# Altium project HAB-Avionics-Sensor-Card.PrjPcb (part 2 of 3)

## Sheet Microcontroller.SchDoc: Payload Card Microcontroller
size A2; Revision: 1A; SheetNumber: 4; SheetTotal: 6; Organization: Brickworks; Address1: Matthew Glazer; Address2: Design Engineer
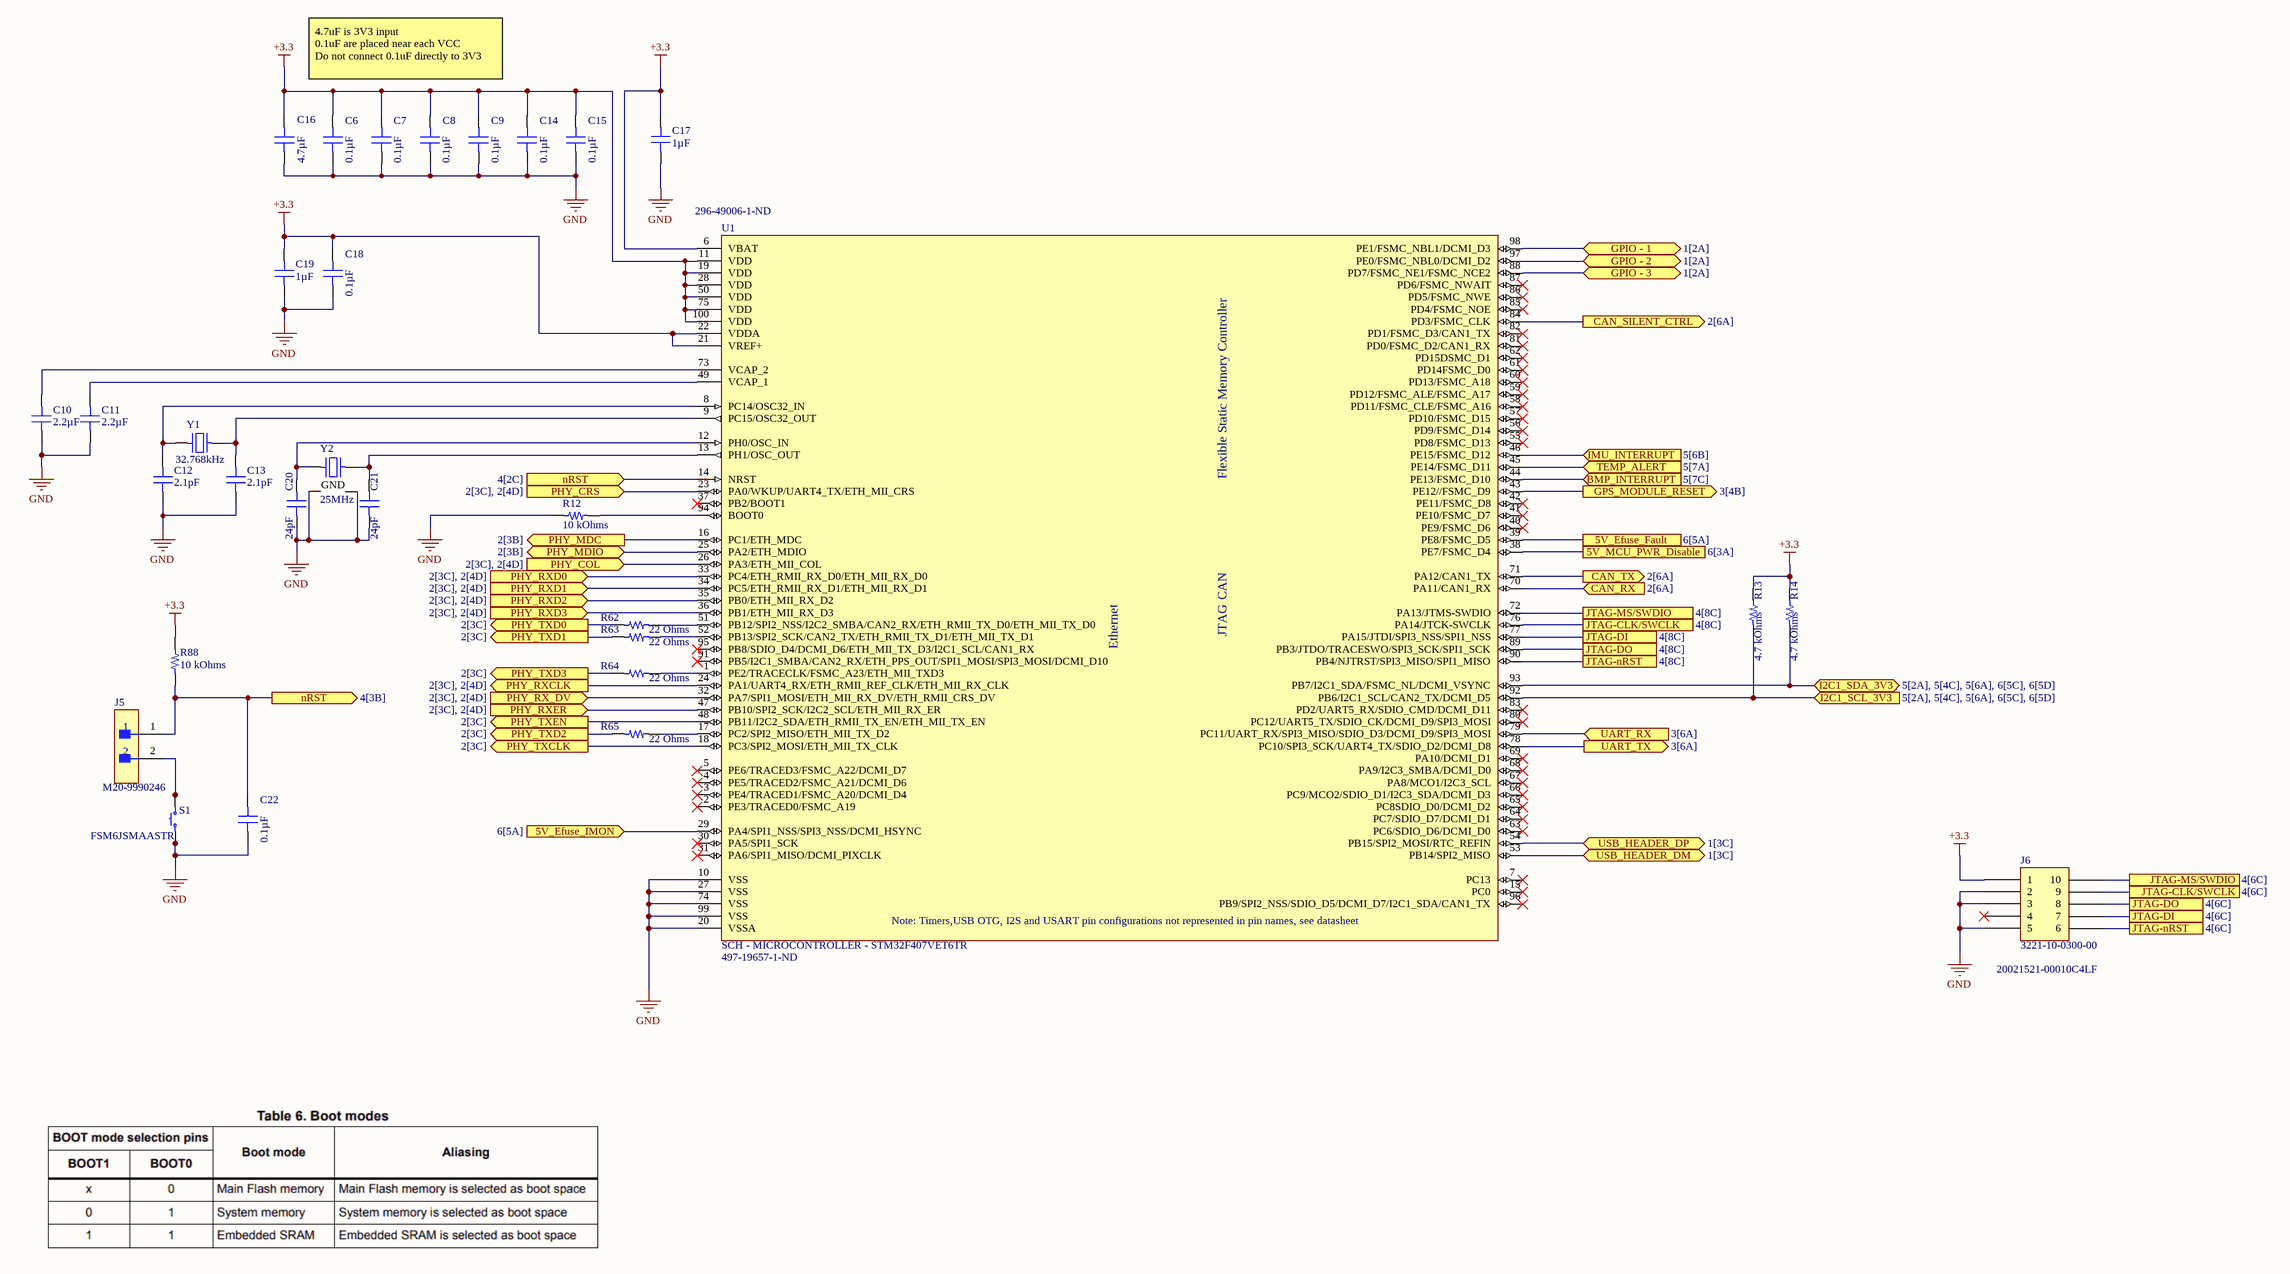
[diagram p3: Microcontroller.SchDoc]

### Parts
C6  0.1µF  [CAP 0603_1608]
C7  0.1µF  [CAP 0603_1608]
C8  0.1µF  [CAP 0603_1608]
C9  0.1µF  [CAP 0603_1608]
C10  2.2µF  [CAP 0603_1608]
C11  2.2µF  [CAP 0603_1608]
C12  2.1pF  [CAP 0603_1608]
C13  2.1pF  [CAP 0603_1608]
C14  0.1µF  [CAP 0603_1608]
C15  0.1µF  [CAP 0603_1608]
C16  4.7µF  [CAP 0603_1608]
C17  1µF  [CAP 0603_1608]
C18  0.1µF  [CAP 0603_1608]
C19  1µF  [CAP 0603_1608]
C20  24pF  [CAP 0603_1608]
C21  24pF  [CAP 0603_1608]
C22  0.1µF  [CAP 0603_1608]
J5  M20-9990246  [FP-M20-9990246-MFG]
J6  3221-10-0300-00  [CNC TECH 3221-10-0300-00]
R12  10 kOhms  [RES 0603_1608]
R13  4.7 kOhms  [RES 0603_1608]
R14  4.7 kOhms  [RES 0603_1608]
R62  22 Ohms  [RES 0603_1608]
R63  22 Ohms  [RES 0603_1608]
R64  22 Ohms  [RES 0603_1608]
R65  22 Ohms  [RES 0603_1608]
R88  10 kOhms  [RES 0603_1608]
S1  FSM6JSMAASTR  [TE FSM6JSMA]
U1  SCH - MICROCONTROLLER - STM32F407VET6TR  Supplier Part Number 1: 497-19657-1-ND  [PCB - LEADLESS - QFP - ST LQFP-100 14X14MM]
Y1  32.768kHz  [ABRACON ABS07]
Y2  25MHz  [EPSON TSX-3225]

### Ports
5V_Efuse_Fault (see 6[5A]), 5V_Efuse_IMON (in, see 6[5A]), 5V_MCU_PWR_Disable (see 6[3A]), BMP_INTERRUPT (in, see 5[7C]), CAN_RX (in, see 2[6A]), CAN_SILENT_CTRL (out, see 2[6A]), CAN_TX (out, see 2[6A]), GPIO - 1 (bidir, see 1[2A]), GPIO - 2 (bidir, see 1[2A]), GPIO - 3 (bidir, see 1[2A]), GPS_MODULE_RESET (out, see 3[4B]), I2C1_SCL_3V3 (in, see 5[2A], 5[4C], 5[6A], 6[5C], 6[5D]), I2C1_SDA_3V3 (bidir, see 5[2A], 5[4C], 5[6A], 6[5C], 6[5D]), IMU_INTERRUPT (in, see 5[6B]), JTAG-CLK/SWCLK (see 4[6C]), JTAG-CLK/SWCLK (see 4[8C]), JTAG-DI (see 4[6C]), JTAG-DI (see 4[8C]), JTAG-DO (see 4[6C]), JTAG-DO (see 4[8C]), JTAG-MS/SWDIO (see 4[6C]), JTAG-MS/SWDIO (see 4[8C]), JTAG-nRST (see 4[6C]), JTAG-nRST (see 4[8C]), nRST (in, see 4[2C]), nRST (out, see 4[3B]), PHY_COL (in, see 2[3C], 2[4D]), PHY_CRS (in, see 2[3C], 2[4D]), PHY_MDC (out, see 2[3B]), PHY_MDIO (bidir, see 2[3B]), PHY_RX_DV (in, see 2[3C], 2[4D]), PHY_RXCLK (out, see 2[3C], 2[4D]), PHY_RXD0 (in, see 2[3C], 2[4D]), PHY_RXD1 (in, see 2[3C], 2[4D]), PHY_RXD2 (in, see 2[3C], 2[4D]), PHY_RXD3 (in, see 2[3C], 2[4D]), PHY_RXER (in, see 2[3C], 2[4D]), PHY_TXCLK (out, see 2[3C]), PHY_TXD0 (out, see 2[3C]), PHY_TXD1 (out, see 2[3C]), PHY_TXD2 (out, see 2[3C]), PHY_TXD3 (out, see 2[3C]), PHY_TXEN (out, see 2[3C]), TEMP_ALERT (in, see 5[7A]), UART_RX (in, see 3[6A]), UART_TX (out, see 3[6A]), USB_HEADER_DM (bidir, see 1[3C]), USB_HEADER_DP (bidir, see 1[3C])

### Nets
+3.3: C6.2 C7.2 C8.2 C9.2 C14.2 C15.2 C16.2 C17.2 C18.2 C19.2 J6.1 R13.2 R14.2 R88.1 U1.6(VBAT) U1.11(VDD) U1.19(VDD) U1.21(VREF+) U1.22(VDDA) U1.28(VDD) U1.50(VDD) U1.75(VDD) U1.100(VDD)
GND: C6.1 C7.1 C8.1 C9.1 C10.1 C11.1 C12.1 C13.1 C14.1 C15.1 C16.1 C17.1 C18.1 C19.1 C20.1 C21.1 C22.1 J6.2 J6.3 J6.5 R12.2 S1.1 S1.2 U1.10(VSS) U1.20(VSSA) U1.27(VSS) U1.74(VSS) U1.99(VSS) Y2.2(GND) Y2.4(GND)
USB_HEADER_N: U1.53(PB14/SPI2_MISO) ; port USB_HEADER_DM
USB_HEADER_P: U1.54(PB15/SPI2_MOSI/RTC_REFIN) ; port USB_HEADER_DP
NetC10_2: C10.2 U1.73(VCAP_2)
NetC11_2: C11.2 U1.49(VCAP_1)
NetC12_2: C12.2 U1.8(PC14/OSC32_IN) Y1.1
NetC13_2: C13.2 U1.9(PC15/OSC32_OUT) Y1.2
NetC20_2: C20.2 U1.12(PH0/OSC_IN) Y2.1
NetC21_2: C21.2 U1.13(PH1/OSC_OUT) Y2.3
NetC22_2: C22.2 J5.1 R88.2 U1.14(NRST) ; port nRST
NetD3_1: U1.38(PE7/FSMC_D4) ; port 5V_MCU_PWR_Disable
NetJ1_14: U1.98(PE1/FSMC_NBL1/DCMI_D3) ; port GPIO - 1
NetJ1_15: U1.97(PE0/FSMC_NBL0/DCMI_D2) ; port GPIO - 2
NetJ1_16: U1.88(PD7/FSMC_NE1/FSMC_NCE2) ; port GPIO - 3
NetJ5_2: J5.2 S1.3 S1.4
NetJ6_6: J6.6 U1.90(PB4/NJTRST/SPI3_MISO/SPI1_MISO) ; port JTAG-nRST
NetJ6_7: J6.7 U1.77(PA15/JTDI/SPI3_NSS/SPI1_NSS) ; port JTAG-DI
NetJ6_8: J6.8 U1.89(PB3/JTDO/TRACESWO/SPI3_SCK/SPI1_SCK) ; port JTAG-DO
NetJ6_9: J6.9 U1.76(PA14/JTCK-SWCLK) ; port JTAG-CLK/SWCLK
NetJ6_10: J6.10 U1.72(PA13/JTMS-SWDIO) ; port JTAG-MS/SWDIO
NetR12_1: R12.1 U1.94(BOOT0)
NetR13_1: R13.1 U1.92(PB6/I2C1_SCL/CAN2_TX/DCMI_D5) ; port I2C1_SCL_3V3
NetR14_1: R14.1 U1.93(PB7/I2C1_SDA/FSMC_NL/DCMI_VSYNC) ; port I2C1_SDA_3V3
NetR21_1: U1.39(PE8/FSMC_D5) ; port 5V_Efuse_Fault
NetR28_2: U1.29(PA4/SPI1_NSS/SPI3_NSS/DCMI_HSYNC) ; port 5V_Efuse_IMON
NetR54_2: U1.84(PD3/FSMC_CLK) ; port CAN_SILENT_CTRL
NetR57_1: U1.25(PA2/ETH_MDIO) ; port PHY_MDIO
NetR61_1: U1.18(PC3/SPI2_MOSI/ETH_MII_TX_CLK) ; port PHY_TXCLK
NetR62_1: R62.1 ; port PHY_TXD0
NetR62_2: R62.2 U1.51(PB12/SPI2_NSS/I2C2_SMBA/CAN2_RX/ETH_RMII_TX_D0/ETH_MII_TX_D0)
NetR63_1: R63.1 ; port PHY_TXD1
NetR63_2: R63.2 U1.52(PB13/SPI2_SCK/CAN2_TX/ETH_RMII_TX_D1/ETH_MII_TX_D1)
NetR64_1: R64.1 ; port PHY_TXD3
NetR64_2: R64.2 U1.1(PE2/TRACECLK/FSMC_A23/ETH_MII_TXD3)
NetR65_1: R65.1 ; port PHY_TXD2
NetR65_2: R65.2 U1.17(PC2/SPI2_MISO/ETH_MII_TX_D2)
NetR66_1: U1.48(PB11/I2C2_SDA/ETH_RMII_TX_EN/ETH_MII_TX_EN) ; port PHY_TXEN
NetR67_1: U1.24(PA1/UART4_RX/ETH_RMII_REF_CLK/ETH_MII_RX_CLK) ; port PHY_RXCLK
NetR68_1: U1.33(PC4/ETH_RMII_RX_D0/ETH_MII_RX_D0) ; port PHY_RXD0
NetR69_1: U1.34(PC5/ETH_RMII_RX_D1/ETH_MII_RX_D1) ; port PHY_RXD1
NetR70_1: U1.35(PB0/ETH_MII_RX_D2) ; port PHY_RXD2
NetR71_1: U1.36(PB1/ETH_MII_RX_D3) ; port PHY_RXD3
NetR74_1: U1.47(PB10/SPI2_SCK/I2C2_SCL/ETH_MII_RX_ER) ; port PHY_RXER
NetR75_1: U1.32(PA7/SPI1_MOSI/ETH_MII_RX_DV/ETH_RMII_CRS_DV) ; port PHY_RX_DV
NetR77_1: U1.23(PA0/WKUP/UART4_TX/ETH_MII_CRS) ; port PHY_CRS
NetR78_1: U1.26(PA3/ETH_MII_COL) ; port PHY_COL
NetU1_16: U1.16(PC1/ETH_MDC) ; port PHY_MDC
NetU1_43: U1.43(PE12//FSMC_D9) ; port GPS_MODULE_RESET
NetU1_44: U1.44(PE13/FSMC_D10) ; port BMP_INTERRUPT
NetU1_45: U1.45(PE14/FSMC_D11) ; port TEMP_ALERT
NetU1_46: U1.46(PE15/FSMC_D12) ; port IMU_INTERRUPT
NetU1_70: U1.70(PA11/CAN1_RX) ; port CAN_RX
NetU1_71: U1.71(PA12/CAN1_TX) ; port CAN_TX
NetU1_78: U1.78(PC10/SPI3_SCK/UART4_TX/SDIO_D2/DCMI_D8) ; port UART_TX
NetU1_79: U1.79(PC11/UART_RX/SPI3_MISO/SDIO_D3/DCMI_D9/SPI3_MOSI) ; port UART_RX

Not connected (* = marked no-connect by the designer): J6 4*; U1 2(PE3/TRACED0/FSMC_A19)* 3(PE4/TRACED1/FSMC_A20/DCMI_D4)* 4(PE5/TRACED2/FSMC_A21/DCMI_D6)* 5(PE6/TRACED3/FSMC_A22/DCMI_D7)* 7(PC13)* 15(PC0)* 30(PA5/SPI1_SCK)* 31(PA6/SPI1_MISO/DCMI_PIXCLK)* 37(PB2/BOOT1)* 40(PE9/FSMC_D6)* 41(PE10/FSMC_D7)* 42(PE11/FSMC_D8)* 55(PD8/FSMC_D13)* 56(PD9/FSMC_D14)* 57(PD10/FSMC_D15)* 58(PD11/FSMC_CLE/FSMC_A16)* 59(PD12/FSMC_ALE/FSMC_A17)* 60(PD13/FSMC_A18)* 61(PD14FSMC_D0)* 62(PD15DSMC_D1)* 63(PC6/SDIO_D6/DCMI_D0)* 64(PC7/SDIO_D7/DCMI_D1)* 65(PC8SDIO_D0/DCMI_D2)* 66(PC9/MCO2/SDIO_D1/I2C3_SDA/DCMI_D3)* 67(PA8/MCO1/I2C3_SCL)* 68(PA9/I2C3_SMBA/DCMI_D0)* 69(PA10/DCMI_D1)* 80(PC12/UART5_TX/SDIO_CK/DCMI_D9/SPI3_MOSI)* 81(PD0/FSMC_D2/CAN1_RX)* 82(PD1/FSMC_D3/CAN1_TX)* 83(PD2/UART5_RX/SDIO_CMD/DCMI_D11)* 85(PD4/FSMC_NOE)* 86(PD5/FSMC_NWE)* 87(PD6/FSMC_NWAIT)* 91(PB5/I2C1_SMBA/CAN2_RX/ETH_PPS_OUT/SPI1_MOSI/SPI3_MOSI/DCMI_D10)* 95(PB8/SDIO_D4/DCMI_D6/ETH_MII_TX_D3/I2C1_SCL/CAN1_RX)* 96(PB9/SPI2_NSS/SDIO_D5/DCMI_D7/I2C1_SDA/CAN1_TX)*

### Notes on the sheet
- 4.7uF is 3V3 input
  0.1uF are placed near each VCC
  Do not connect 0.1uF directly to 3V3
- (near J6) 20021521-00010C4LF
- Title
- Size:
- Date:
- File:
- A2
- Number:
- Time:
- Revision:
- Sheet
- of
- (in symbol SCH - MICROCONTROLLER - STM32F407VET6TR) Flexible Static Memory Controller; CAN; JTAG; Ethernet; Note: Timers,USB OTG, I2S and USART pin configurations not represented in pin names, see datasheet

### Library data of the parts
C6-C9 C14 C15 C18 C22 = CL10B104KA8WPNC: CAP CER 0.1UF 25V X7R 0603; Manufacturer: Samsung Electro-Mechanics; Tolerance: ±10%; Part Number: CL10B104KA8WPNC; Value: 0.1µF; Applications: Automotive; Capacitance: 0.1µF; ComponentLink1Description: Datasheet; ComponentLink1URL: http://www.samsungsem.com/kr/support/product-search/mlcc/CL10B104KA8WPNC.jsp; ComponentLink2Description: DigiKey Link; ComponentLink2URL: http://digikey.com/product-detail/en/samsung-electro-mechanics/CL10B104KA8WPNC/1276-6717-1-ND/5961576; Device Package: 0603 (1608 Metric); Features: Open Mode; LastUpdated: 9/2/2020 1:03:30 AM; Lifecycle Status: Active; Minimum Order: 1; Mounting Type: Surface Mount, MLCC; Operating Temperature: -55°C ~ 125°C; Package / Case: 0603 (1608 Metric); Packaging: TapeAndReel; PartId: 5631; Part Status: Active; Price: 0.02; Ratings: AEC-Q200; Series: CL; Size / Dimension: 0.063" L x 0.031" W (1.60mm x 0.80mm); Supplier 1: DigiKey; Supplier Part Number 1: 1276-6717-1-ND; Temperature Coefficient: X7R; Thickness (Max): 0.035" (0.90mm); Voltage - Rated: 25V
C10 C11 = EMK107BJ225KA-T: CAP CER 2.2UF 16V X5R 0603; Manufacturer: Taiyo Yuden; Tolerance: ±10%; Part Number: EMK107BJ225KA-T; Value: 2.2µF; Applications: General Purpose; Capacitance: 2.2µF; ComponentLink1Description: Datasheet; ComponentLink1URL: https://ds.yuden.co.jp/TYCOMPAS/ut/detail?pn=EMK107BJ225KA-T  &u=M; ComponentLink2Description: DigiKey Link; ComponentLink2URL: http://digikey.com/product-detail/en/taiyo-yuden/EMK107BJ225KA-T/587-1430-1-ND/1004061; Device Package: 0603 (1608 Metric); LastUpdated: 9/2/2020 1:03:30 AM; Lifecycle Status: Active; Minimum Order: 1; Mounting Type: Surface Mount, MLCC; Operating Temperature: -55°C ~ 85°C; Package / Case: 0603 (1608 Metric); Packaging: TapeAndReel; PartId: 5619; Part Status: Active; Price: 0.02; Series: M; Size / Dimension: 0.063" L x 0.031" W (1.60mm x 0.80mm); Supplier 1: DigiKey; Supplier Part Number 1: 587-1430-1-ND; Temperature Coefficient: X5R; Thickness (Max): 0.035" (0.90mm); Voltage - Rated: 16V
C12 C13 = CBR06C219B5GAC: CAP CER RF 2.1PF 50V +/-0.1 PF C; Manufacturer: KEMET; Temperature Coefficient: C0G, NP0; Tolerance: ±0.1pF; Part Number: CBR06C219B5GAC; Value: 2.1pF; Applications: RF, Microwave, High Frequency; Capacitance: 2.1pF; ComponentLink1Description: Datasheet; ComponentLink1URL: https://api.kemet.com/component-edge/download/datasheet/CBR06C219B5GAC.pdf; ComponentLink2Description: DigiKey Link; ComponentLink2URL: http://digikey.com/product-detail/en/kemet/CBR06C219B5GAC/399-16153-1-ND/7649738; Device Package: 0603 (1608 Metric); Features: High Q, Low Loss, Ultra Low ESR; LastUpdated: 9/2/2020 1:03:15 AM; Lifecycle Status: Active; Minimum Order: 1; Mounting Type: Surface Mount, MLCC; Operating Temperature: -55°C ~ 125°C; Package / Case: 0603 (1608 Metric); Packaging: TapeAndReel; PartId: 13663; Part Status: Active; Price: 0.05; Series: CBR-SMD RF C0G; Size / Dimension: 0.063" L x 0.031" W (1.60mm x 0.80mm); Supplier 1: DigiKey; Supplier Part Number 1: 399-16153-1-ND; Thickness (Max): 0.034" (0.87mm); Voltage - Rated: 50V
C16 = C1608X5R1C475K080AC: CAP CER 4.7UF 16V X5R 0603; Manufacturer: TDK Corporation; Tolerance: ±10%; Part Number: C1608X5R1C475K080AC; Value: 4.7µF; Applications: General Purpose; Capacitance: 4.7µF; ComponentLink1Description: Datasheet; ComponentLink1URL: https://product.tdk.com/info/en/catalog/datasheets/mlcc_commercial_general_en.pdf?ref_disty=digikey; ComponentLink2Description: DigiKey Link; ComponentLink2URL: http://digikey.com/product-detail/en/tdk-corporation/C1608X5R1C475K080AC/445-7478-1-ND/2733550; Device Package: 0603 (1608 Metric); Features: Low ESL; LastUpdated: 9/2/2020 1:03:17 AM; Lifecycle Status: Active; Minimum Order: 1; Mounting Type: Surface Mount, MLCC; Operating Temperature: -55°C ~ 85°C; Package / Case: 0603 (1608 Metric); Packaging: TapeAndReel; PartId: 12901; Part Status: Active; Price: 0.06; Series: C; Size / Dimension: 0.063" L x 0.031" W (1.60mm x 0.80mm); Supplier 1: DigiKey; Supplier Part Number 1: 445-7478-1-ND; Temperature Coefficient: X5R; Thickness (Max): 0.035" (0.90mm); Voltage - Rated: 16V
C17 C19 = GCM188R71C105KA64J: CAP CER 1UF 16V X7R 0603; Manufacturer: Murata Electronics; Tolerance: ±10%; Part Number: GCM188R71C105KA64J; Value: 1µF; Applications: Automotive; Capacitance: 1µF; ComponentLink1Description: Datasheet; ComponentLink1URL: https://www.murata.com/~/media/webrenewal/support/library/catalog/products/capacitor/mlcc/c03e.ashx?la=en-us; ComponentLink2Description: DigiKey Link; ComponentLink2URL: http://digikey.com/product-detail/en/murata-electronics/GCM188R71C105KA64J/490-12657-1-ND/5797626; Device Package: 0603 (1608 Metric); LastUpdated: 9/2/2020 1:03:14 AM; Lifecycle Status: Active; Minimum Order: 1; Mounting Type: Surface Mount, MLCC; Operating Temperature: -55°C ~ 125°C; Package / Case: 0603 (1608 Metric); Packaging: TapeAndReel; PartId: 13992; Part Status: Active; Price: 0.03; Ratings: AEC-Q200; Series: GCM; Size / Dimension: 0.063" L x 0.031" W (1.60mm x 0.80mm); Supplier 1: DigiKey; Supplier Part Number 1: 490-12657-1-ND; Temperature Coefficient: X7R; Thickness (Max): 0.035" (0.90mm); Voltage - Rated: 16V
C20 C21 = CL10C240JB8NNNC: CAP CER 24PF 50V C0G/NP0 0603; Manufacturer: Samsung Electro-Mechanics; Temperature Coefficient: C0G, NP0; Tolerance: ±5%; Part Number: CL10C240JB8NNNC; Value: 24pF; Applications: General Purpose; Capacitance: 24pF; ComponentLink1Description: Datasheet; ComponentLink1URL: http://www.samsungsem.com/kr/support/product-search/mlcc/CL10C240JB8NNNC.jsp; ComponentLink2Description: DigiKey Link; ComponentLink2URL: http://digikey.com/product-detail/en/samsung-electro-mechanics/CL10C240JB8NNNC/1276-1761-1-ND/3889847; Device Package: 0603 (1608 Metric); LastUpdated: 9/2/2020 1:03:22 AM; Lifecycle Status: Active; Minimum Order: 1; Mounting Type: Surface Mount, MLCC; Operating Temperature: -55°C ~ 125°C; Package / Case: 0603 (1608 Metric); Packaging: TapeAndReel; PartId: 10003; Part Status: Active; Price: 0.01; Series: CL; Size / Dimension: 0.063" L x 0.031" W (1.60mm x 0.80mm); Supplier 1: DigiKey; Supplier Part Number 1: 1276-1761-1-ND; Thickness (Max): 0.035" (0.90mm); Voltage - Rated: 50V
J5 = CMP-15831-000009-1: CONN HEADER VERT 2POS 2.54MM; Manufacturer: Harwin; Conn Gender: Male; Conn Orientation: Vertical; Number Of Contacts: 2; Current Rating: 3A; ComponentLink2URL: https://cdn.harwin.com/pdfs/M20-999.pdf; ComponentLink2Description: Datasheet; Package: M20-9990246; Temperature: -40°C to +105°C; Octopart: https://octopart.com/m20-9990246-harwin-2590635; Mouser Description: 2.54mm (0.1") Pitch SIL Vertical PC Tail Pin Header, 6.1mm mating pin height, tin, 2 contacts; Temperature Range High: +105°C; Device Class L1: Connectors; RoHS: TRUE; Automotive: No; Height: 8.99mm; Number Of Rows: 1; Contact Material: Tin,Nickel; Category: Conn; Pitch: 2.54mm; Lead Free: Yes; Digikey Description: CONN HEADER VERT 2POS 2.54MM; Manufacturer Part Number: M20-9990246; Temperature Range Low: -40°C; Device Class L3: unset; Device Class L2: Headers and Wire Housings
J6 = 3221-10-0300-00: CONN HEADER SMD 10POS 1.27MM; Manufacturer: CNC Tech; Current Rating (Amps): 1A; Material Flammability Rating: UL94 V-0; Number of Positions: 10; Number of Positions Loaded: All; Pitch - Mating: 0.050" (1.27mm); Shrouding: Shrouded - 4 Wall; Style: Board to Cable/Wire; Part Number: 3221-10-0300-00; ComponentLink1Description: Datasheet; ComponentLink1URL: http://cnctech.us/idcmatching2.pdf; ComponentLink2Description: DigiKey Link; ComponentLink2URL: http://digikey.com/product-detail/en/cnc-tech/3221-10-0300-00/1175-1735-ND/4878946; Connector Type: Header; Contact Finish - Mating: Gold; Contact Finish - Post: Gold; Contact Finish Thickness - Mating: Flash; Contact Material: Brass; Contact Shape: Square; Contact Type: Male Pin; Fastening Type: Push-Pull; Features: Keying Slot; Insulation Height: 0.213" (5.40mm); Insulation Material: Polyamide (PA6T), Nylon 6T; LastUpdated: 1/13/2020 12:09:21 AM; Lifecycle Status: Active; Minimum Order: 1; Mounting Type: Surface Mount; Number of Rows: 2; Operating Temperature: -40°C ~ 105°C; Packaging: Tray; PartId: 109; Part Status: Active; Price: 0.73; Row Spacing - Mating: 0.050" (1.27mm); Series: -; Supplier 1: DigiKey; Supplier Part Number 1: 1175-1735-ND; Termination: Solder
R12 R88 = RMCF0603JT10K0: RES 10K OHM 5% 1/10W 0603; Manufacturer: Stackpole Electronics Inc; Power (Watts): 0.1W, 1/10W; Temperature Coefficient: ±200ppm/°C; Part Number: RMCF0603JT10K0; Value: 10 kOhms; ComponentLink1Description: Datasheet; ComponentLink1URL: https://www.seielect.com/catalog/sei-packaging.pdf; ComponentLink2Description: DigiKey Link; ComponentLink2URL: http://digikey.com/product-detail/en/stackpole-electronics-inc/RMCF0603JT10K0/RMCF0603JT10K0CT-ND/1943191; Composition: Thick Film; Device Package: 0603 (1608 Metric); Features: Automotive AEC-Q200; Height - Seated (Max): 0.022" (0.55mm); LastUpdated: 8/30/2020 8:48:45 PM; Lifecycle Status: Active; Minimum Order: 1; Number of Terminations: 2; Operating Temperature: -55°C ~ 155°C; Package / Case: 0603 (1608 Metric); Packaging: CutTape; PartId: 25659; Part Status: Active; Price: 0.10; Ratings: AEC-Q200; Resistance: 10 kOhms; Series: RMCF; Size / Dimension: 0.061" L x 0.031" W (1.55mm x 0.80mm); Supplier 1: DigiKey; Supplier Part Number 1: RMCF0603JT10K0CT-ND; Supplier Device Package: 0603; Tolerance: ±5%
R13 R14 = RMCF0603FT4K70: RES 4.7K OHM 1% 1/10W 0603; Manufacturer: Stackpole Electronics Inc; Power (Watts): 0.1W, 1/10W; Temperature Coefficient: ±100ppm/°C; Part Number: RMCF0603FT4K70; Value: 4.7 kOhms; ComponentLink1Description: Datasheet; ComponentLink1URL: https://www.seielect.com/catalog/sei-rmcf_rmcp.pdf; ComponentLink2Description: DigiKey Link; ComponentLink2URL: http://digikey.com/product-detail/en/stackpole-electronics-inc/RMCF0603FT4K70/RMCF0603FT4K70CT-ND/1943033; Composition: Thick Film; Device Package: 0603 (1608 Metric); Features: Automotive AEC-Q200; Height - Seated (Max): 0.022" (0.55mm); LastUpdated: 9/2/2020 1:10:22 AM; Lifecycle Status: Active; Minimum Order: 1; Number of Terminations: 2; Operating Temperature: -55°C ~ 155°C; Package / Case: 0603 (1608 Metric); Packaging: CutTape; PartId: 6078; Part Status: Active; Price: 0.10; Ratings: AEC-Q200; Resistance: 4.7 kOhms; Series: RMCF; Size / Dimension: 0.061" L x 0.031" W (1.55mm x 0.80mm); Supplier 1: DigiKey; Supplier Part Number 1: RMCF0603FT4K70CT-ND; Supplier Device Package: 0603; Tolerance: ±1%
R62-R65 = RMCF0603FT22R0: RES 22 OHM 1% 1/10W 0603; Manufacturer: Stackpole Electronics Inc; Power (Watts): 0.1W, 1/10W; Temperature Coefficient: ±100ppm/°C; Part Number: RMCF0603FT22R0; Value: 22 Ohms; ComponentLink1Description: Datasheet; ComponentLink1URL: https://www.seielect.com/catalog/sei-packaging.pdf; ComponentLink2Description: DigiKey Link; ComponentLink2URL: http://digikey.com/product-detail/en/stackpole-electronics-inc/RMCF0603FT22R0/RMCF0603FT22R0CT-ND/1942946; Composition: Thick Film; Device Package: 0603 (1608 Metric); Features: Automotive AEC-Q200; Height - Seated (Max): 0.022" (0.55mm); LastUpdated: 9/2/2020 1:10:13 AM; Lifecycle Status: Active; Minimum Order: 1; Number of Terminations: 2; Operating Temperature: -55°C ~ 155°C; Package / Case: 0603 (1608 Metric); Packaging: CutTape; PartId: 10611; Part Status: Active; Price: 0.10; Ratings: AEC-Q200; Resistance: 22 Ohms; Series: RMCF; Size / Dimension: 0.061" L x 0.031" W (1.55mm x 0.80mm); Supplier 1: DigiKey; Supplier Part Number 1: RMCF0603FT22R0CT-ND; Supplier Device Package: 0603; Tolerance: ±1%
S1 = FSM6JSMAASTR: SWITCH TACTILE SPST-NO 0.05A 24V; Manufacturer: TE Connectivity ALCOSWITCH Switches; Actuator Height off PCB, Vertical: 7.00mm; Actuator Orientation: Top Actuated; Actuator Type: Standard; Contact Rating @ Voltage: 0.05A @ 24VDC; Illumination: Non-Illuminated; Operating Force: 260gf; Outline: 6.00mm x 6.00mm; Switch Function: Off-Mom; Part Number: FSM6JSMAASTR; Circuit: SPST-NO; ComponentLink1Description: Datasheet; ComponentLink1URL: https://www.te.com/commerce/DocumentDelivery/DDEController?Action=srchrtrv&DocNm=1308111-1_SWITCHES_CORE_PROGRAM_CATALOG&DocType=CS&DocLang=English; ComponentLink2Description: DigiKey Link; ComponentLink2URL: http://digikey.com/product-detail/en/te-connectivity-alcoswitch-switches/FSM6JSMAASTR/450-2138-1-ND/5343818; LastUpdated: 9/2/2020 1:27:08 AM; Lifecycle Status: Active; Minimum Order: 1; Mounting Type: Surface Mount; Operating Temperature: -40°C ~ 105°C; Packaging: TapeAndReel; Part Status: Active; Price: 0.37; Series: FSMJSMA; Supplier 1: DigiKey; Supplier Part Number 1: 450-2138-1-ND; Termination Style: Gull Wing
Y1 = ABS07-166-32.768KHZ-T: IOT 32.786KHZ XTAL; Manufacturer: Abracon LLC; ESR (Equivalent Series Resistance): 70 kOhms; Frequency Tolerance: ±10ppm; Load Capacitance: 7pF; Operating Mode: Fundamental; Part Number: ABS07-166-32.768KHZ-T; ComponentLink1Description: Datasheet; ComponentLink1URL: https://abracon.com/datasheets/ABS07-166-32.768kHz-T.pdf; ComponentLink2Description: DigiKey Link; ComponentLink2URL: http://digikey.com/product-detail/en/abracon-llc/ABS07-166-32.768KHZ-T/535-14514-1-ND/8827205; Frequency: 32.768kHz; Height - Seated (Max): 0.035" (0.90mm); LastUpdated: 9/2/2020 1:21:47 AM; Lifecycle Status: Active; Minimum Order: 1; Mounting Type: Surface Mount; Operating Temperature: -40°C ~ 85°C; Package / Case: 2-SMD, No Lead; Packaging: TapeAndReel; PartId: 384; Part Status: Active; Price: 0.35; Series: ABS07; Size / Dimension: 0.126" L x 0.059" W (3.20mm x 1.50mm); Supplier 1: DigiKey; Supplier Part Number 1: 535-14514-1-ND; Type: kHz Crystal (Tuning Fork); Value: 32.768kHz
Y2 = TSX-3225 25.0000MF20P-C0: CRYSTAL 25.0000MHZ 18PF SMD; Manufacturer: EPSON; ESR (Equivalent Series Resistance): 40 Ohms; Frequency Stability: ±20ppm; Frequency Tolerance: ±10ppm; Operating Mode: Fundamental; Part Number: TSX-3225 25.0000MF20P-C0; ComponentLink1Description: Datasheet; ComponentLink1URL: https://support.epson.biz/td/api/doc_check.php?dl=brief_TSX-3225&lang=en; ComponentLink2Description: DigiKey Link; ComponentLink2URL: http://digikey.com/product-detail/en/epson/TSX-3225-25.0000MF20P-C0/SER4212CT-ND/7430967; Frequency: 25MHz; Height - Seated (Max): 0.024" (0.60mm); LastUpdated: 9/2/2020 1:21:54 AM; Lifecycle Status: Active; Load Capacitance: 18pF; Minimum Order: 1; Mounting Type: Surface Mount; Operating Temperature: -20°C ~ 85°C; Package / Case: 4-SMD, No Lead; Packaging: TapeAndReel; PartId: 447; Part Status: Active; Price: 0.18; Series: TSX-3225; Size / Dimension: 0.126" L x 0.098" W (3.20mm x 2.50mm); Supplier 1: DigiKey; Supplier Part Number 1: SER4212CT-ND; Type: MHz Crystal; Value: 25MHz
U1 = SCH - MICROCONTROLLER - STM32F407VET6TR: Supplier 1: Digi-Key

## Sheet Sensors.SchDoc: Payload Card Sensors
size A3; Revision: 1A; SheetNumber: 5; SheetTotal: 6; Organization: Brickworks; Address1: Matthew Glazer; Address2: Design Engineer
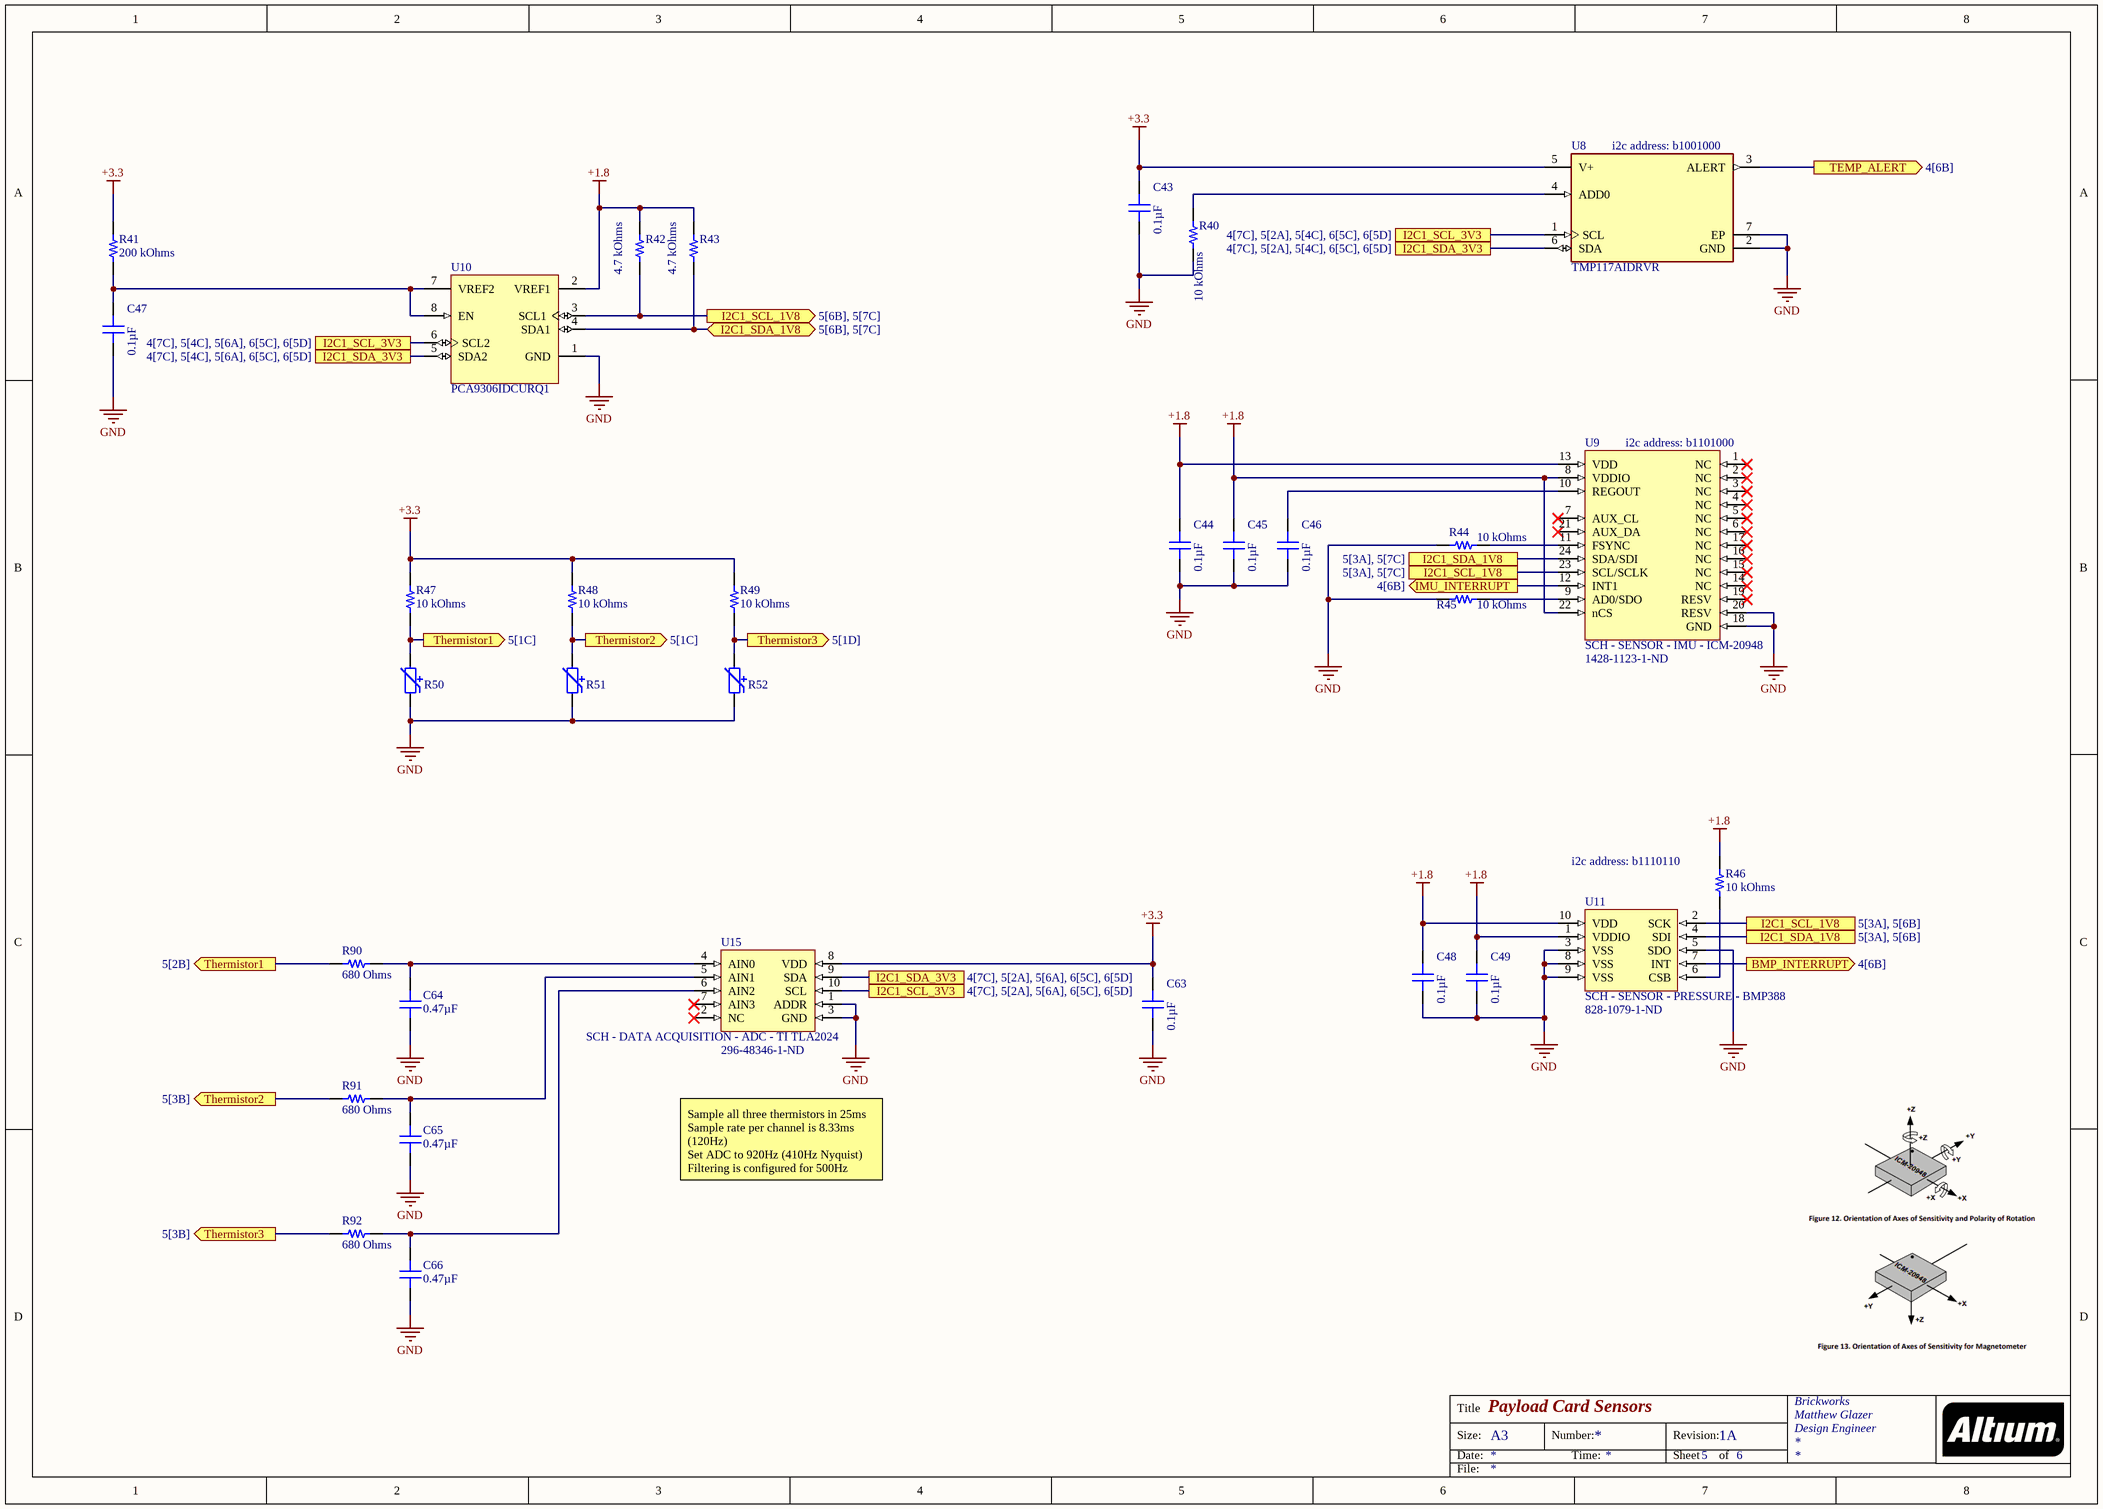
[diagram p4: Sensors.SchDoc]

### Parts
C43  0.1µF  [CAP 0603_1608]
C44  0.1µF  [CAP 0603_1608]
C45  0.1µF  [CAP 0603_1608]
C46  0.1µF  [CAP 0603_1608]
C47  0.1µF  [CAP 0603_1608]
C48  0.1µF  [CAP 0603_1608]
C49  0.1µF  [CAP 0603_1608]
C63  0.1µF  [CAP 0603_1608]
C64  0.47µF  [CAP 0603_1608]
C65  0.47µF  [CAP 0603_1608]
C66  0.47µF  [CAP 0603_1608]
R40  10 kOhms  [RES 0603_1608]
R41  200 kOhms  [RES 0603_1608]
R42  4.7 kOhms  [RES 0603_1608]
R43  4.7 kOhms  [RES 0603_1608]
R44  10 kOhms  [RES 0603_1608]
R45  10 kOhms  [RES 0603_1608]
R46  10 kOhms  [RES 0603_1608]
R47  10 kOhms  [RES 0603_1608]
R48  10 kOhms  [RES 0603_1608]
R49  10 kOhms  [RES 0603_1608]
R50  10 kOhms  [PTC 0402_1005]  (value not drawn)
R51  10 kOhms  [PTC 0402_1005]  (value not drawn)
R52  10 kOhms  [PTC 0402_1005]  (value not drawn)
R90  680 Ohms  [RES 0603_1608]
R91  680 Ohms  [RES 0603_1608]
R92  680 Ohms  [RES 0603_1608]
U8  TMP117AIDRVR  [FP-DRV0006A-MFG]
U9  SCH - SENSOR - IMU - ICM-20948  Supplier Part Number 1: 1428-1123-1-ND  [PCB - LEADLESS - QFN - TDK 24-TFQFN]
U10  PCA9306IDCURQ1  [DCU0008A_M]
U11  SCH - SENSOR - PRESSURE - BMP388  Supplier Part Number 1: 828-1079-1-ND  [PCB - LEADLESS - BOSCH LGA10]
U15  SCH - DATA ACQUISITION - ADC - TI TLA2024  Supplier Part Number 1: 296-48346-1-ND  [PCB - LEADLESS - QFN - TI X2QFN-10]

### Ports
BMP_INTERRUPT (out, see 4[6B]), I2C1_SCL_1V8 (out, see 5[6B], 5[7C]), I2C1_SCL_1V8 (see 5[3A], 5[6B]), I2C1_SCL_1V8 (see 5[3A], 5[7C]), I2C1_SCL_3V3 (see 4[7C], 5[2A], 5[4C], 6[5C], 6[5D]), I2C1_SCL_3V3 (see 4[7C], 5[2A], 5[6A], 6[5C], 6[5D]), I2C1_SCL_3V3 (see 4[7C], 5[4C], 5[6A], 6[5C], 6[5D]), I2C1_SDA_1V8 (bidir, see 5[6B], 5[7C]), I2C1_SDA_1V8 (see 5[3A], 5[6B]), I2C1_SDA_1V8 (see 5[3A], 5[7C]), I2C1_SDA_3V3 (see 4[7C], 5[2A], 5[4C], 6[5C], 6[5D]), I2C1_SDA_3V3 (see 4[7C], 5[2A], 5[6A], 6[5C], 6[5D]), I2C1_SDA_3V3 (see 4[7C], 5[4C], 5[6A], 6[5C], 6[5D]), IMU_INTERRUPT (out, see 4[6B]), TEMP_ALERT (out, see 4[6B]), Thermistor1 (out, see 5[1C]), Thermistor1 (out, see 5[2B]), Thermistor2 (out, see 5[1C]), Thermistor2 (out, see 5[3B]), Thermistor3 (out, see 5[1D]), Thermistor3 (out, see 5[3B])

### Nets
+1.8: C44.2 C45.2 C48.2 C49.2 R42.2 R43.2 R46.1 U9.8(VDDIO) U9.13(VDD) U9.22(nCS) U10.2(VREF1) U11.1(VDDIO) U11.10(VDD)
+3.3: C43.2 C63.2 R41.2 R47.2 R48.2 R49.2 U8.5(V+) U15.8(VDD)
GND: C43.1 C44.1 C45.1 C46.1 C47.1 C48.1 C49.1 C63.1 C64.1 C65.1 C66.1 R40.1 R44.2 R45.2 R50.1 R51.1 R52.1 U8.2(GND) U8.7(EP) U9.18(GND) U9.20(RESV) U10.1(GND) U11.3(VSS) U11.5(SDO) U11.8(VSS) U11.9(VSS) U15.1(ADDR) U15.3(GND)
NetC46_2: C46.2 U9.10(REGOUT)
NetC47_2: C47.2 R41.1 U10.7(VREF2) U10.8(EN)
NetC64_2: C64.2 R90.2 U15.4(AIN0)
NetC65_2: C65.2 R91.2 U15.5(AIN1)
NetC66_2: C66.2 R92.2 U15.6(AIN2)
NetR13_1: U8.1(SCL) U10.6(SCL2) U15.10(SCL) ; port I2C1_SCL_3V3
NetR14_1: U8.6(SDA) U10.5(SDA2) U15.9(SDA) ; port I2C1_SDA_3V3
NetR40_2: R40.2 U8.4(ADD0)
NetR42_1: R42.1 U9.23(SCL/SCLK) U10.3(SCL1) U11.2(SCK) ; port I2C1_SCL_1V8
NetR43_1: R43.1 U9.24(SDA/SDI) U10.4(SDA1) U11.4(SDI) ; port I2C1_SDA_1V8
NetR44_1: R44.1 U9.11(FSYNC)
NetR45_1: R45.1 U9.9(AD0/SDO)
NetR46_2: R46.2 U11.6(CSB)
NetR47_1: R47.1 R50.2 R90.1 ; port Thermistor1
NetR48_1: R48.1 R51.2 R91.1 ; port Thermistor2
NetR49_1: R49.1 R52.2 R92.1 ; port Thermistor3
NetU1_44: U11.7(INT) ; port BMP_INTERRUPT
NetU1_45: U8.3(ALERT) ; port TEMP_ALERT
NetU1_46: U9.12(INT1) ; port IMU_INTERRUPT

Not connected (* = marked no-connect by the designer): U9 1(NC)* 2(NC)* 3(NC)* 4(NC)* 5(NC)* 6(NC)* 7(AUX_CL)* 14(NC)* 15(NC)* 16(NC)* 17(NC)* 19(RESV)* 21(AUX_DA)*; U15 2(NC)* 7(AIN3)*

### Notes on the sheet
- (near U8) i2c address: b1001000
- (near U9) i2c address: b1101000
- (near R46) i2c address: b1110110
- Sample all three thermistors in 25ms
  Sample rate per channel is 8.33ms (120Hz)
  Set ADC to 920Hz (410Hz Nyquist)
  Filtering is configured for 500Hz
- Title
- Size:
- Date:
- A3
- Number:
- Time:
- Revision:
- Sheet
- of
- File:

### Library data of the parts
C43-C49 C63 = CL10B104KA8WPNC: as C6 on sheet Microcontroller; Part Number: CL10B104KA8WPNC; Value: 0.1µF; Applications: Automotive; Capacitance: 0.1µF; ComponentLink1Description: Datasheet; ComponentLink1URL: http://www.samsungsem.com/kr/support/product-search/mlcc/CL10B104KA8WPNC.jsp; ComponentLink2Description: DigiKey Link; ComponentLink2URL: http://digikey.com/product-detail/en/samsung-electro-mechanics/CL10B104KA8WPNC/1276-6717-1-ND/5961576; Device Package: 0603 (1608 Metric); Features: Open Mode; LastUpdated: 9/2/2020 1:03:30 AM; Lifecycle Status: Active; Minimum Order: 1; Mounting Type: Surface Mount, MLCC; Operating Temperature: -55°C ~ 125°C; Package / Case: 0603 (1608 Metric); Packaging: TapeAndReel; PartId: 5631; Part Status: Active; Price: 0.02; Ratings: AEC-Q200; Series: CL; Size / Dimension: 0.063" L x 0.031" W (1.60mm x 0.80mm); Supplier 1: DigiKey; Supplier Part Number 1: 1276-6717-1-ND; Temperature Coefficient: X7R; Thickness (Max): 0.035" (0.90mm); Voltage - Rated: 25V
C64-C66 = C0603C474K4PACTU: CAP CER 0.47UF 16V X5R 0603; Manufacturer: KEMET; Tolerance: ±10%; Part Number: C0603C474K4PACTU; Value: 0.47µF; Applications: General Purpose; Capacitance: 0.47µF; ComponentLink1Description: Datasheet; ComponentLink1URL: https://api.kemet.com/component-edge/download/datasheet/C0603C474K4PACTU.pdf; ComponentLink2Description: DigiKey Link; ComponentLink2URL: http://digikey.com/product-detail/en/kemet/C0603C474K4PACTU/399-7934-1-ND/3471657; Device Package: 0603 (1608 Metric); LastUpdated: 9/2/2020 1:03:36 AM; Lifecycle Status: Active; Minimum Order: 1; Mounting Type: Surface Mount, MLCC; Operating Temperature: -55°C ~ 85°C; Package / Case: 0603 (1608 Metric); Packaging: TapeAndReel; PartId: 2292; Part Status: Active; Price: 0.02; Series: SMD Comm X5R; Size / Dimension: 0.063" L x 0.031" W (1.60mm x 0.80mm); Supplier 1: DigiKey; Supplier Part Number 1: 399-7934-1-ND; Temperature Coefficient: X5R; Thickness (Max): 0.034" (0.87mm); Voltage - Rated: 16V
R40 R44-R46 = RMCF0603JT10K0: as R12 on sheet Microcontroller; Part Number: RMCF0603JT10K0; Value: 10 kOhms; ComponentLink1Description: Datasheet; ComponentLink1URL: https://www.seielect.com/catalog/sei-packaging.pdf; ComponentLink2Description: DigiKey Link; ComponentLink2URL: http://digikey.com/product-detail/en/stackpole-electronics-inc/RMCF0603JT10K0/RMCF0603JT10K0CT-ND/1943191; Composition: Thick Film; Device Package: 0603 (1608 Metric); Features: Automotive AEC-Q200; Height - Seated (Max): 0.022" (0.55mm); LastUpdated: 8/30/2020 8:48:45 PM; Lifecycle Status: Active; Minimum Order: 1; Number of Terminations: 2; Operating Temperature: -55°C ~ 155°C; Package / Case: 0603 (1608 Metric); Packaging: CutTape; PartId: 25659; Part Status: Active; Price: 0.10; Ratings: AEC-Q200; Resistance: 10 kOhms; Series: RMCF; Size / Dimension: 0.061" L x 0.031" W (1.55mm x 0.80mm); Supplier 1: DigiKey; Supplier Part Number 1: RMCF0603JT10K0CT-ND; Supplier Device Package: 0603; Tolerance: ±5%
R41 = RMCF0603FT200K: RES 200K OHM 1% 1/10W 0603; Manufacturer: Stackpole Electronics Inc; Power (Watts): 0.1W, 1/10W; Temperature Coefficient: ±100ppm/°C; Part Number: RMCF0603FT200K; Value: 200 kOhms; ComponentLink1Description: Datasheet; ComponentLink1URL: https://www.seielect.com/catalog/sei-rmcf_rmcp.pdf; ComponentLink2Description: DigiKey Link; ComponentLink2URL: http://digikey.com/product-detail/en/stackpole-electronics-inc/RMCF0603FT200K/RMCF0603FT200KCT-ND/1943126; Composition: Thick Film; Device Package: 0603 (1608 Metric); Features: Automotive AEC-Q200; Height - Seated (Max): 0.022" (0.55mm); LastUpdated: 9/2/2020 1:10:13 AM; Lifecycle Status: Active; Minimum Order: 1; Number of Terminations: 2; Operating Temperature: -55°C ~ 155°C; Package / Case: 0603 (1608 Metric); Packaging: CutTape; PartId: 10646; Part Status: Active; Price: 0.10; Ratings: AEC-Q200; Resistance: 200 kOhms; Series: RMCF; Size / Dimension: 0.061" L x 0.031" W (1.55mm x 0.80mm); Supplier 1: DigiKey; Supplier Part Number 1: RMCF0603FT200KCT-ND; Supplier Device Package: 0603; Tolerance: ±1%
R42 R43 = RMCF0603FT4K70: as R13 on sheet Microcontroller; Part Number: RMCF0603FT4K70; Value: 4.7 kOhms; ComponentLink1Description: Datasheet; ComponentLink1URL: https://www.seielect.com/catalog/sei-rmcf_rmcp.pdf; ComponentLink2Description: DigiKey Link; ComponentLink2URL: http://digikey.com/product-detail/en/stackpole-electronics-inc/RMCF0603FT4K70/RMCF0603FT4K70CT-ND/1943033; Composition: Thick Film; Device Package: 0603 (1608 Metric); Features: Automotive AEC-Q200; Height - Seated (Max): 0.022" (0.55mm); LastUpdated: 9/2/2020 1:10:22 AM; Lifecycle Status: Active; Minimum Order: 1; Number of Terminations: 2; Operating Temperature: -55°C ~ 155°C; Package / Case: 0603 (1608 Metric); Packaging: CutTape; PartId: 6078; Part Status: Active; Price: 0.10; Ratings: AEC-Q200; Resistance: 4.7 kOhms; Series: RMCF; Size / Dimension: 0.061" L x 0.031" W (1.55mm x 0.80mm); Supplier 1: DigiKey; Supplier Part Number 1: RMCF0603FT4K70CT-ND; Supplier Device Package: 0603; Tolerance: ±1%
R47-R49 = RMCF0603FT10K0: RES 10K OHM 1% 1/10W 0603; Manufacturer: Stackpole Electronics Inc; Power (Watts): 0.1W, 1/10W; Temperature Coefficient: ±100ppm/°C; Part Number: RMCF0603FT10K0; Value: 10 kOhms; ComponentLink1Description: Datasheet; ComponentLink1URL: https://www.seielect.com/catalog/sei-rmcf_rmcp.pdf; ComponentLink2Description: DigiKey Link; ComponentLink2URL: http://digikey.com/product-detail/en/stackpole-electronics-inc/RMCF0603FT10K0/RMCF0603FT10K0CT-ND/1943057; Composition: Thick Film; Device Package: 0603 (1608 Metric); Features: Automotive AEC-Q200; Height - Seated (Max): 0.022" (0.55mm); LastUpdated: 9/2/2020 1:09:31 AM; Lifecycle Status: Active; Minimum Order: 1; Number of Terminations: 2; Operating Temperature: -55°C ~ 155°C; Package / Case: 0603 (1608 Metric); Packaging: CutTape; PartId: 25663; Part Status: Active; Price: 0.10; Ratings: AEC-Q200; Resistance: 10 kOhms; Series: RMCF; Size / Dimension: 0.061" L x 0.031" W (1.55mm x 0.80mm); Supplier 1: DigiKey; Supplier Part Number 1: RMCF0603FT10K0CT-ND; Supplier Device Package: 0603; Tolerance: ±1%
R50-R52 = TMP6131DECR: SENSOR PTC 10KOHM 1% X1SON; Manufacturer: Texas Instruments; ComponentLink1Description: Datasheet; ComponentLink1URL: http://www.ti.com/general/docs/suppproductinfo.tsp?distId=10&gotoUrl=http%3A%2F%2Fwww.ti.com%2Flit%2Fgpn%2Ftmp61; ComponentLink2Description: DigiKey Link; ComponentLink2URL: http://digikey.com/product-detail/en/texas-instruments/TMP6131DECR/296-TMP6131DECRCT-ND/10435285; Device Package: 0402 (1006 Metric); LastUpdated: 9/2/2020 1:30:57 AM; Lifecycle Status: Active; Part Number: TMP6131DECR; Minimum Order: 1; Mounting Type: Surface Mount; Operating Temperature: -40°C ~ 125°C (TA); Package / Case: 0402 (1006 Metric); Packaging: TapeAndReel; Part Status: Active; Price: 0.07; Resistance @ 25°C: 10 kOhms; Resistance Tolerance: ±1%; Series: Commercial; Supplier 1: DigiKey; Supplier Part Number 1: 296-TMP6131DECRCT-ND; Supplier Device Package: 2-X1SON (1x.60); Value: 10 kOhms
R90-R92 = RMCF0603FT680R: RES 680 OHM 1% 1/10W 0603; Manufacturer: Stackpole Electronics Inc; Power (Watts): 0.1W, 1/10W; Temperature Coefficient: ±100ppm/°C; Part Number: RMCF0603FT680R; Value: 680 Ohms; ComponentLink1Description: Datasheet; ComponentLink1URL: https://www.seielect.com/catalog/sei-packaging.pdf; ComponentLink2Description: DigiKey Link; ComponentLink2URL: http://digikey.com/product-detail/en/stackpole-electronics-inc/RMCF0603FT680R/RMCF0603FT680RCT-ND/6053170; Composition: Thick Film; Device Package: 0603 (1608 Metric); Features: Automotive AEC-Q200; Height - Seated (Max): 0.022" (0.55mm); LastUpdated: 9/2/2020 1:10:13 AM; Lifecycle Status: Active; Minimum Order: 1; Number of Terminations: 2; Operating Temperature: -55°C ~ 155°C; Package / Case: 0603 (1608 Metric); Packaging: CutTape; PartId: 10671; Part Status: Active; Price: 0.10; Ratings: AEC-Q200; Resistance: 680 Ohms; Series: RMCF; Size / Dimension: 0.061" L x 0.031" W (1.55mm x 0.80mm); Supplier 1: DigiKey; Supplier Part Number 1: RMCF0603FT680RCT-ND; Supplier Device Package: 0603; Tolerance: ±1%
U8 = CMP-04948-000009-1: TEMPERATURE SENSOR; Manufacturer: Texas Instruments; Operating Supply Current: 3.5-16uA; Standoff Height: 0mm; Min Supply Voltage: 1.8V; Resolution: 16bits; Interface: I2C,2-Wire,SMBus; Max Junction Temp: +150°C; Max Supply Voltage: 5.5V; Octopart: https://octopart.com/tmp117aidrvr-texas+instruments-95511044; Lead Free: Yes; ComponentLink2Description: Datasheet; Temperature Range High: +150°C; Manufacturer Part Number: TMP117AIDRVR; Ambient Temperature Range High: +150°C; Ambient Temperature Range Low: -55°C; Height: 0.8mm; ComponentLink2URL: http://www.ti.com/lit/ds/symlink/tmp117.pdf; Automotive: No; Device Class L1: Sensors; RoHS: TRUE; Package: DRV0006A; Device Class L3: unset; Temperature: -55°C to +150°C; Temperature Range Low: -55°C; Ipc Land Pattern Name: DFN200X200X80-6; Device Class L2: Temperature and Humidity Sensors; Category: IC; Digikey Description: TEMPERATURE SENSOR
U10 = CMP-0314-00424-2: Automotive Catalog Dual Bidirectional I2C Bus and SMBus Voltage-Level Translator, 0 to 5.5 V,-40 to 85 degC,8-pin US8 (DCU), Green (RoHS & no Sb/Br); Manufacturer: Texas Instruments; fSCLK(Max)(MHz): 400; Vcc range(V): 0 to 5.5; 5V Tolerant I/O: Yes; tpd max(ns): 1.4; Function: Voltage Translator; SubFamily: I2C Special Function; No. of Outputs: 2; Mounting Technology: Surface Mount; ComponentLink1Description: Datasheet; ComponentLink2Description: Package Specification; PackageReference: DCU0008A; Rating: Automotive; PackageVersion: revF, Jul-2005; Eco-Plan: Green (RoHS & no Sb/Br); ComponentLink2URL: http://www.ti.com/litv/pdf/mpds050d; Max Frequency(kHz): 400; Open Drain I/O Type: Yes; On-Chip Power-on-Reset: No; PartNumber: PCA9306IDCURQ1; Code_JEDEC: MO-187-CA; DatasheetVersion: SCPS178; PackageDescription: 8-Pin Thin Shrink Small Outline Package 0.5 mm Pitch; ComponentLink1URL: http://www.ti.com/general/docs/lit/getliterature.tsp?genericPartNumber=PCA9306-Q1&fileType=pdf; Enable Pin: Yes
U9 = SCH - SENSOR - IMU - ICM-20948: Supplier 1: Digi-Key
U11 = SCH - SENSOR - PRESSURE - BMP388: Supplier 1: Digi-Key
U15 = SCH - DATA ACQUISITION - ADC - TI TLA2024: Supplier 1: Digi-Key